# EAGLE design PTN78000 (EAGLE 6.4)
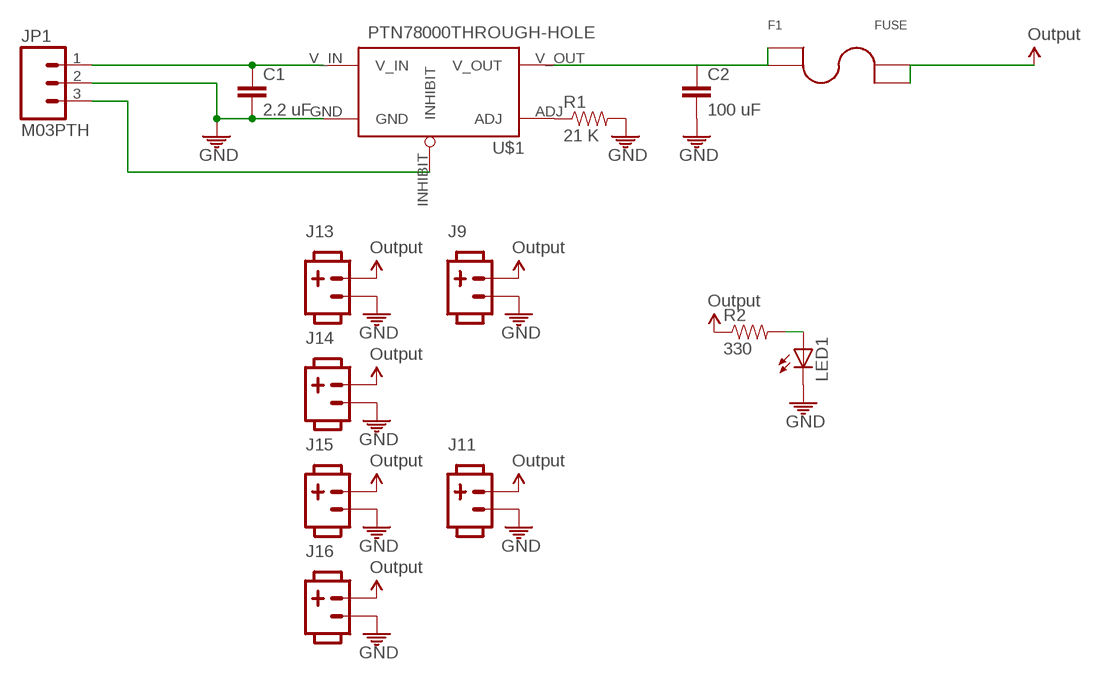
[diagram p0: schematic, sheet 1]

## Parts
C1  2.2 uF  CAP1206  [1206]
C2  100 uF  CAP1206  [1206]
F1  FUSE  [FUSE_2AG]
J9  POW_CONNECTFEMALE-RA  [SOCKET-FEMALE_RA-3.96MM-2]
J11  POW_CONNECTFEMALE-RA  [SOCKET-FEMALE_RA-3.96MM-2]
J13  POW_CONNECTFEMALE-RA  [SOCKET-FEMALE_RA-3.96MM-2]
J14  POW_CONNECTFEMALE-RA  [SOCKET-FEMALE_RA-3.96MM-2]
J15  POW_CONNECTFEMALE-RA  [SOCKET-FEMALE_RA-3.96MM-2]
J16  POW_CONNECTFEMALE-RA  [SOCKET-FEMALE_RA-3.96MM-2]
JP1  M03PTH  [1X03]
LED1  LED5MM  [LED5MM]
R1  21 K  RESISTOR1206  [1206]
R2  330  RESISTOR1206  [1206]
U$1  PTN78000THROUGH-HOLE  [PTN78000]

## Nets
GND: C1.2 C2.2 J9.2 J11.2 J13.2 J14.2 J15.2 J16.2 JP1.2 LED1.K(C) R1.2 U$1.GND
N$1: C1.1 JP1.1 U$1.V_IN
N$2: R1.1 U$1.ADJ
N$4: JP1.3 U$1.INHIBIT
N$5: C2.1 F1.P$1 F1.P$2 U$1.V_OUT
N$6: LED1.A R2.2
VCC5V0: F1.P$3 F1.P$4 J9.1 J11.1 J13.1 J14.1 J15.1 J16.1 R2.1 ; supply symbol labelled Output

## Library data of the parts
C1 C2 = ASL:CAP: Capacitor Standard 0603 ceramic capacitor, and 0.1" leaded capacitor.
F1 = ASL:FUSE
J9 J11 J13-J16 = ASL:POW_CONNECT
JP1 = ASL:M03: Header 3 Standard 3-pin 0.1" header. Use with straight break away headers (SKU : PRT-00116), right angle break away headers (PRT-00553), swiss pins (PRT-00743), machine pins (PRT-00117), and female headers (PRT-00115). Molex polarized connector foot print use with SKU : PRT-08232 with associated crimp pins and housings.
LED1 = SparkFun-LED:LED: LEDs Standard schematic elements and footprints for 5mm, 3mm, 1206, and 0603 sized LEDs. 5mm - Spark Fun Electronics SKU : COM-00529 (and others)
R1 R2 = ASL:RESISTOR: Resistor Basic schematic elements and footprints for 0603, 1206, and PTH resistors.
U$1 = ASL:PTN78000: This is the PTN78000 part by Texas Instruments. It's a 1.5A adjustable switching regulator.

## Board
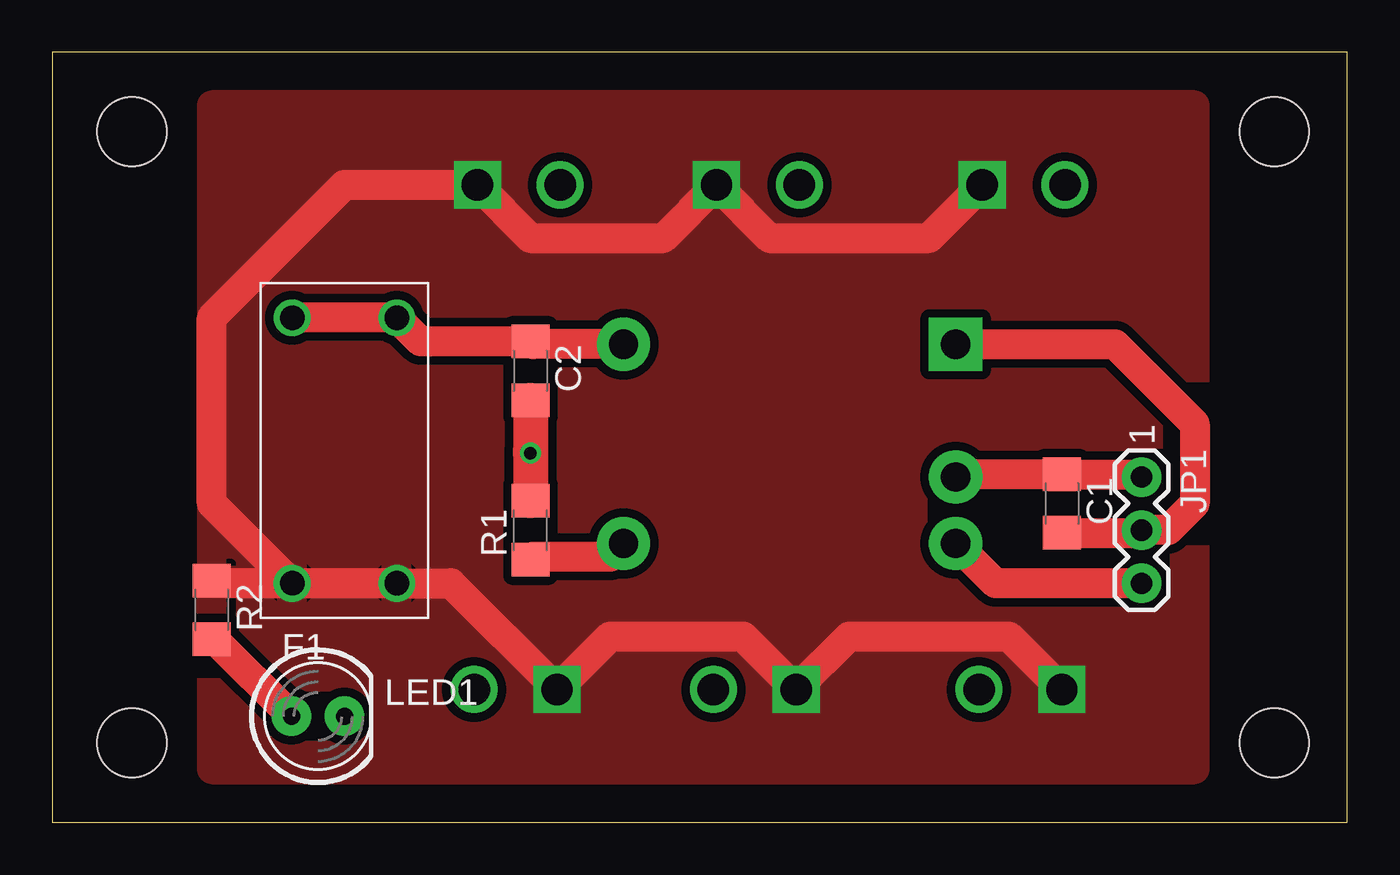
[diagram p1: board, top side]
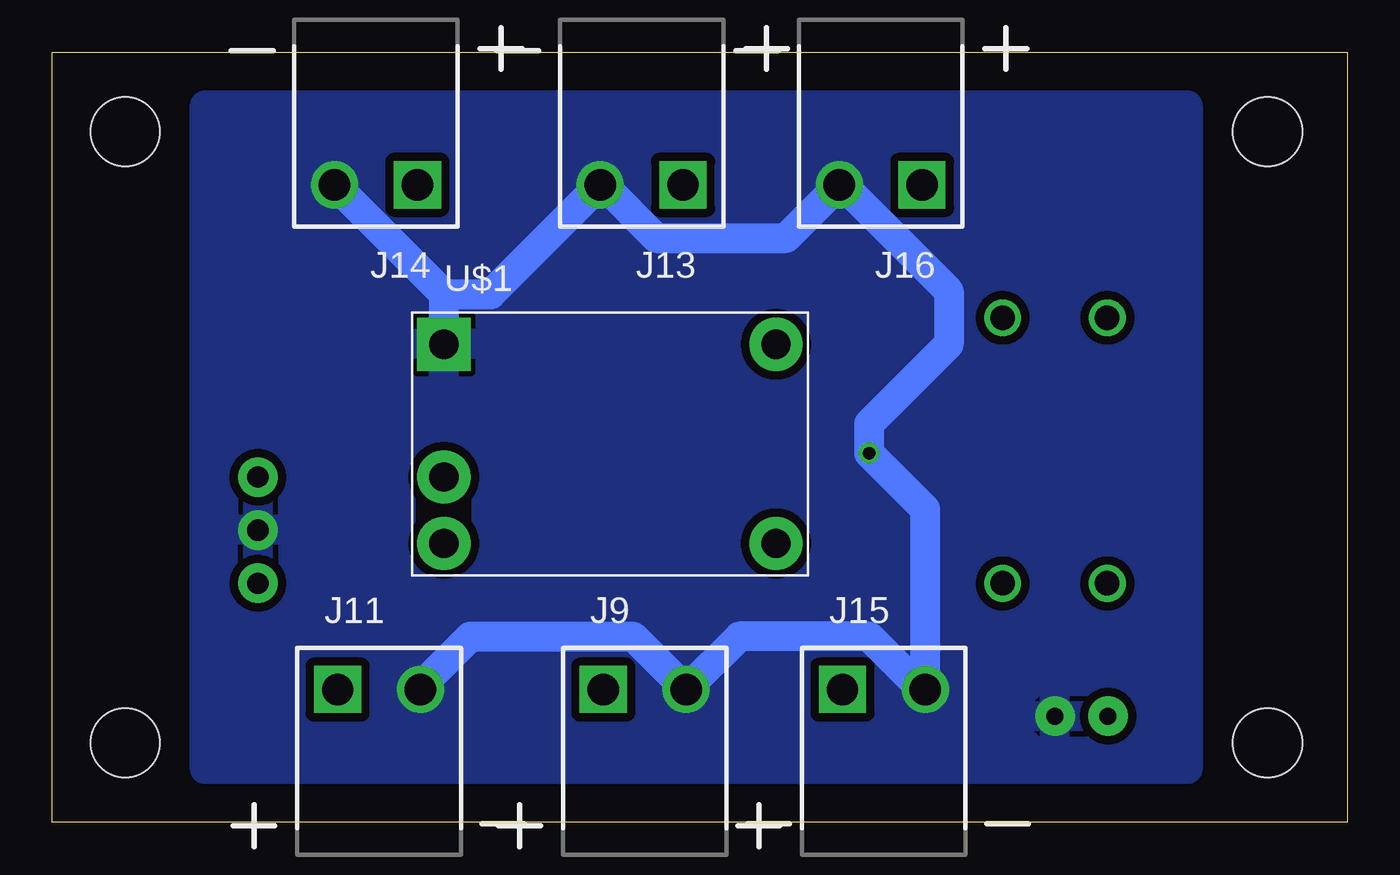
[diagram p2: board, bottom side, seen from below]

Size 61.9 x 36.82 mm. Coordinates in mm from the lower left corner, seen from the top.
Outline: 0,0 61.9,0 61.9,36.82 0,36.82 0,0
Copper layers (1*16): Top 0.035mm / dielectric 1.5mm / Bottom 0.035mm
Design rules "default": minimum track width 10mil, minimum drill 24mil, track to track 8mil, track to pad 8mil, pad to pad 8mil, via to via 8mil, smd to smd 8mil, copper to edge 40mil, drill to drill 8mil, minimum pad ring 10mil, minimum via ring 8mil, stop-mask expansion 4mil, vias tented up to drill 0mil, thermal gap 10mil

### Footprints (pad centres in the part's own frame; a part is rotated, then mirrored left to right if it is on the bottom)
1206 = smd 1.6 x 1.8: 1 -1.4,0; 2 1.4,0
FUSE_2AG = drill 1.17: P$1 -2.5,6.35; P$2 2.5,6.35; P$3 -2.5,-6.35; P$4 2.5,-6.35
SOCKET-FEMALE_RA-3.96MM-2 = drill 1.5 square: 1 0,0 | drill 1.5: 2 3.96,0
1X03 = drill 1.016 pad 1.88: 1 -2.54,0; 2 0,0; 3 2.54,0
LED5MM = drill 0.813 pad 1.88: A -1.27,0; K 1.27,0
PTN78000 = drill 1.397 pad 2.54: ADJ 15.875,-9.525; INHIBIT 0,-9.525; V_IN 0,-6.35; V_OUT 15.875,0 | drill 1.397 pad 2.54 square: GND 0,0
STAND-OFF = hole 3.302: 0,0

### Placement (x,y rotation side)
C1  48.26,15.24 270 top
C2  22.86,21.59 270 top
F1  13.97,17.78 0 top
J9  35.56,6.35 0 bottom
J11  48.26,6.35 0 bottom
J13  31.75,30.48 180 bottom
J14  44.45,30.48 180 bottom
J15  24.13,6.35 0 bottom
J16  20.32,30.48 180 bottom
JP1  52.07,13.97 270 top
LED1  12.7,5.08 0 top
R1  22.86,13.97 90 top
R2  7.62,10.16 270 top
U$1  43.18,22.86 0 bottom
U$6  [STAND-OFF]  3.81,3.81 0 top
U$11  [STAND-OFF]  3.81,33.02 0 top
U$12  [STAND-OFF]  58.42,33.02 0 top
U$13  [STAND-OFF]  58.42,3.81 0 top

### Tracks (layer width: path | path; a pad name or v marks a point on that pad's centre or on a via)
GND  (via drill 0.6 pad 0.41)
  Top 1.422: C1.2 51.94,13.84 JP1.2 53.34,13.97 54.61,15.24 54.61,19.05 50.8,22.86 U$1.GND | R1.2 22.86,17.78
  Top 1.676: C2.2 22.86,17.78 v22.86,17.65 R1.2
  Bottom 1.422: U$1.GND 43.18,25.25 | 43.18,25.25 J14.2 | 43.18,25.25 40.94,25.25 J13.2 35.56,30.48 33.02,27.94 26.82,27.94 J16.2 24.13,30.48 19.05,25.4 19.05,22.86 22.86,19.05 v22.86,17.65 20.17,14.96 J15.2 20.32,6.35 22.86,8.89 29.06,8.89 J9.2 34.14,8.89 41.91,8.89 44.3,6.5 J11.2
  pour Bottom (isolate 0.406): 7.62,34.29 7.62,2.54 54.61,2.54 54.61,34.29
N$1
  Top 1.422: U$1.V_IN 43.31,16.64 C1.1 51.94,16.64 JP1.1
N$2
  Top 1.422: U$1.ADJ 26.67,12.7 22.99,12.7 R1.1
N$4
  Top 1.422: JP1.3 45.09,11.43 U$1.INHIBIT
N$5
  Top 1.422: U$1.V_OUT 22.99,22.86 C2.1 17.61,22.99 F1.P$2 F1.P$1
N$6
  Top 1.422: R2.2 7.75,8.76 LED1.A
VCC5V0
  Top 1.422: 11.43,11.43 F1.P$3 F1.P$4 19.05,11.43 J15.1 26.67,8.89 33.02,8.89 J9.1 38.1,8.89 45.72,8.89 J11.1 | 11.43,11.43 7.75,11.43 R2.1 | 11.43,11.43 7.62,15.24 7.62,24.13 13.97,30.48 J16.1 22.86,27.94 29.21,27.94 J13.1 34.29,27.94 41.91,27.94 J14.1
  pour Top (isolate 0.406): 7.62,34.29 7.62,2.54 54.61,2.54 54.61,34.29